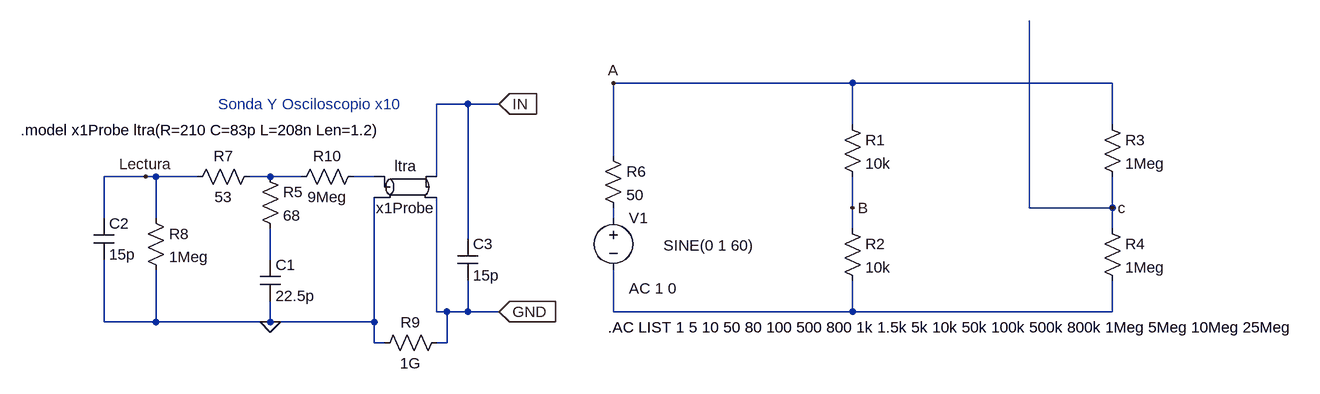
[diagram p0: schematic LAB0_Analoga2_x1.asc]
LAB0_Analoga2_x1.asc, the LTspice schematic file:
Version 4
SHEET 1 880 680
WIRE 112 48 -256 48
WIRE 512 48 112 48
WIRE -480 80 -528 80
WIRE -432 80 -480 80
WIRE 112 112 112 48
WIRE 512 112 512 48
WIRE -256 160 -256 48
WIRE -976 192 -1040 192
WIRE -960 192 -976 192
WIRE -896 192 -960 192
WIRE -784 192 -816 192
WIRE -736 192 -784 192
WIRE -624 192 -656 192
WIRE -528 192 -528 80
WIRE 112 240 112 192
WIRE 384 240 384 -48
WIRE 512 240 512 192
WIRE 512 240 384 240
WIRE -1040 256 -1040 192
WIRE -960 256 -960 192
WIRE -256 256 -256 240
WIRE 112 272 112 240
WIRE 512 272 512 240
WIRE -480 288 -480 80
WIRE -784 320 -784 272
WIRE -528 400 -528 224
WIRE -512 400 -528 400
WIRE -480 400 -480 352
WIRE -480 400 -512 400
WIRE -432 400 -480 400
WIRE -256 400 -256 336
WIRE 112 400 112 352
WIRE 112 400 -256 400
WIRE 512 400 512 352
WIRE 512 400 112 400
WIRE -1040 416 -1040 320
WIRE -960 416 -960 336
WIRE -960 416 -1040 416
WIRE -784 416 -784 384
WIRE -784 416 -960 416
WIRE -624 416 -624 224
WIRE -624 416 -784 416
WIRE -624 448 -624 416
WIRE -608 448 -624 448
WIRE -512 448 -512 400
WIRE -512 448 -528 448
FLAG 112 240 B
FLAG -256 48 A
FLAG 512 240 c
FLAG -976 192 Lectura
FLAG -784 416 0
FLAG -432 80 IN
IOPIN -432 80 In
FLAG -432 400 GND
IOPIN -432 400 In
SYMBOL res 96 96 R0
SYMATTR InstName R1
SYMATTR Value 10k
SYMBOL res 96 256 R0
SYMATTR InstName R2
SYMATTR Value 10k
SYMBOL res 496 96 R0
SYMATTR InstName R3
SYMATTR Value 1Meg
SYMBOL res 496 256 R0
SYMATTR InstName R4
SYMATTR Value 1Meg
SYMBOL voltage -256 240 R0
WINDOW 3 77 58 Left 2
WINDOW 123 24 124 Left 2
WINDOW 39 24 152 Left 2
SYMATTR Value SINE(0 1 60)
SYMATTR Value2 AC 1 0
SYMATTR InstName V1
SYMBOL res -272 144 R0
SYMATTR InstName R6
SYMATTR Value 50
SYMBOL ltline -576 208 R0
SYMATTR InstName ltra
SYMATTR Value x1Probe
SYMBOL res -800 176 R0
SYMATTR InstName R5
SYMATTR Value 68
SYMBOL cap -800 320 R0
SYMATTR InstName C1
SYMATTR Value 22.5p
SYMBOL res -800 176 R90
WINDOW 0 0 56 VBottom 2
WINDOW 3 32 56 VTop 2
SYMATTR InstName R7
SYMATTR Value 53
SYMBOL res -976 240 R0
SYMATTR InstName R8
SYMATTR Value 1Meg
SYMBOL cap -1056 256 R0
SYMATTR InstName C2
SYMATTR Value 15p
SYMBOL res -512 432 R90
WINDOW 0 0 56 VBottom 2
WINDOW 3 32 56 VTop 2
SYMATTR InstName R9
SYMATTR Value 1G
SYMBOL cap -496 288 R0
SYMATTR InstName C3
SYMATTR Value 15p
SYMBOL res -640 176 R90
WINDOW 0 0 56 VBottom 2
WINDOW 3 32 56 VTop 2
SYMATTR InstName R10
SYMATTR Value 9Meg
TEXT -264 424 Left 2 !.AC LIST 1 5 10 50 80 100 500 800 1k 1.5k 5k 10k 50k 100k 500k 800k 1Meg 5Meg 10Meg 25Meg
TEXT -1168 120 Left 2 !.model x1Probe ltra(R=210 C=83p L=208n Len=1.2)
TEXT -864 80 Left 2 ;Sonda Y Osciloscopio x10

The netlist it stands for:
* LAB0_Analoga2_x1.asc
R1 A B 10k
R2 B N005 10k
R3 A c 1Meg
R4 c N005 1Meg
V1 N003 N005 SINE(0 1 60) AC 1 0
R6 A N003 50
O§ltra N002 0 IN GND x1Probe
R5 N001 N004 68
C1 N004 0 22.5p
R7 N001 Lectura 53
R8 Lectura 0 1Meg
C2 Lectura 0 15p
R9 GND 0 1G
C3 IN GND 15p
R10 N002 N001 9Meg
.AC LIST 1 5 10 50 80 100 500 800 1k 1.5k 5k 10k 50k 100k 500k 800k 1Meg 5Meg 10Meg 25Meg
.model x1Probe ltra(R=210 C=83p L=208n Len=1.2)
* Sonda Y Osciloscopio x10
.backanno
.end